# Altium schematic sheet MCU.SchDoc
size A3; DocumentNumber: 2; SheetNumber: 2; SheetTotal: 5
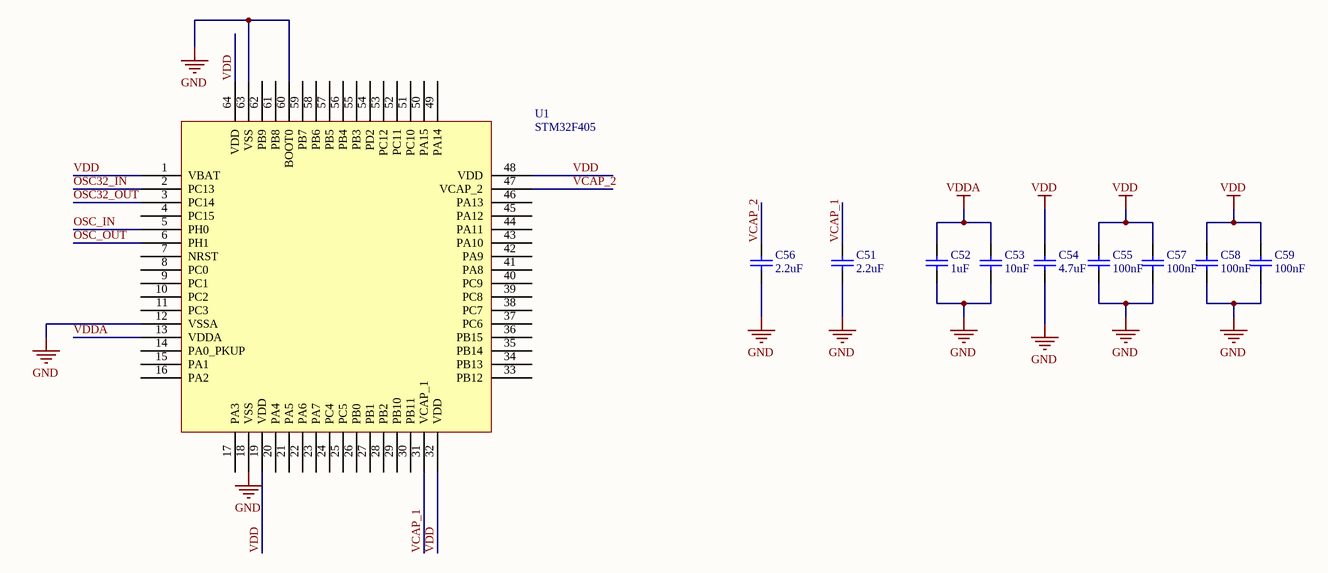
[diagram p0: MCU.SchDoc]

## Parts
C51  value 2.2uF  [1608[0603]]  (hidden comment: Cap Semi)
C52  value 1uF  [1608[0603]]  (hidden comment: Cap Semi)
C53  value 10nF  [1608[0603]]  (hidden comment: Cap Semi)
C54  value 4.7uF  [1608[0603]]  (hidden comment: Cap Semi)
C55  value 100nF  [1608[0603]]  (hidden comment: Cap Semi)
C56  value 2.2uF  [1608[0603]]  (hidden comment: Cap Semi)
C57  value 100nF  [1608[0603]]  (hidden comment: Cap Semi)
C58  value 100nF  [1608[0603]]  (hidden comment: Cap Semi)
C59  value 100nF  [1608[0603]]  (hidden comment: Cap Semi)
U1  STM32F405  [SQFP50P1200X1200-64L]

## Nets
GND: C51.1 C52.1 C53.1 C54.1 C55.1 C56.1 C57.1 C58.1 C59.1 U1.12(VSSA) U1.18(VSS) U1.60(BOOT0) U1.63(VSS)
VDD: C54.2 C55.2 C57.2 C58.2 C59.2 U1.1(VBAT) U1.19(VDD) U1.32(VDD) U1.48(VDD) U1.64(VDD)
VDDA: C52.2 C53.2 U1.13(VDDA)
OSC32_IN: U1.2(PC13)
OSC32_OUT: U1.3(PC14)
OSC_IN: U1.5(PH0)
OSC_OUT: U1.6(PH1)
VCAP_1: C51.2 U1.31(VCAP_1)
VCAP_2: C56.2 U1.47(VCAP_2)

Not connected (* = marked no-connect by the designer): U1 4(PC15) 7(NRST) 8(PC0) 9(PC1) 10(PC2) 11(PC3) 14(PA0_PKUP) 15(PA1) 16(PA2) 17(PA3) 20(PA4) 21(PA5) 22(PA6) 23(PA7) 24(PC4) 25(PC5) 26(PB0) 27(PB1) 28(PB2) 29(PB10) 30(PB11) 33(PB12) 34(PB13) 35(PB14) 36(PB15) 37(PC6) 38(PC7) 39(PC8) 40(PC9) 41(PA8) 42(PA9) 43(PA10) 44(PA11) 45(PA12) 46(PA13) 49(PA14) 50(PA15) 51(PC10) 52(PC11) 53(PC12) 54(PD2) 55(PB3) 56(PB4) 57(PB5) 58(PB6) 59(PB7) 61(PB8) 62(PB9)

## Library data of the parts
C51-C59 = Cap Semi: Capacitor (Semiconductor SIM Model); Published: 8-Jun-2000; LatestRevisionDate: 29-May-2009; LatestRevisionNote: IPC-7351 Footprint Added.; PackageReference: C1206; Publisher: Altium Limited; PackageDescription: Chip Capacitor
U1 = STM32F405RG: ARM Cortex-M4 32 bit Microprocessor